# Altium schematic sheet ADPL_improved.SchDoc
size B
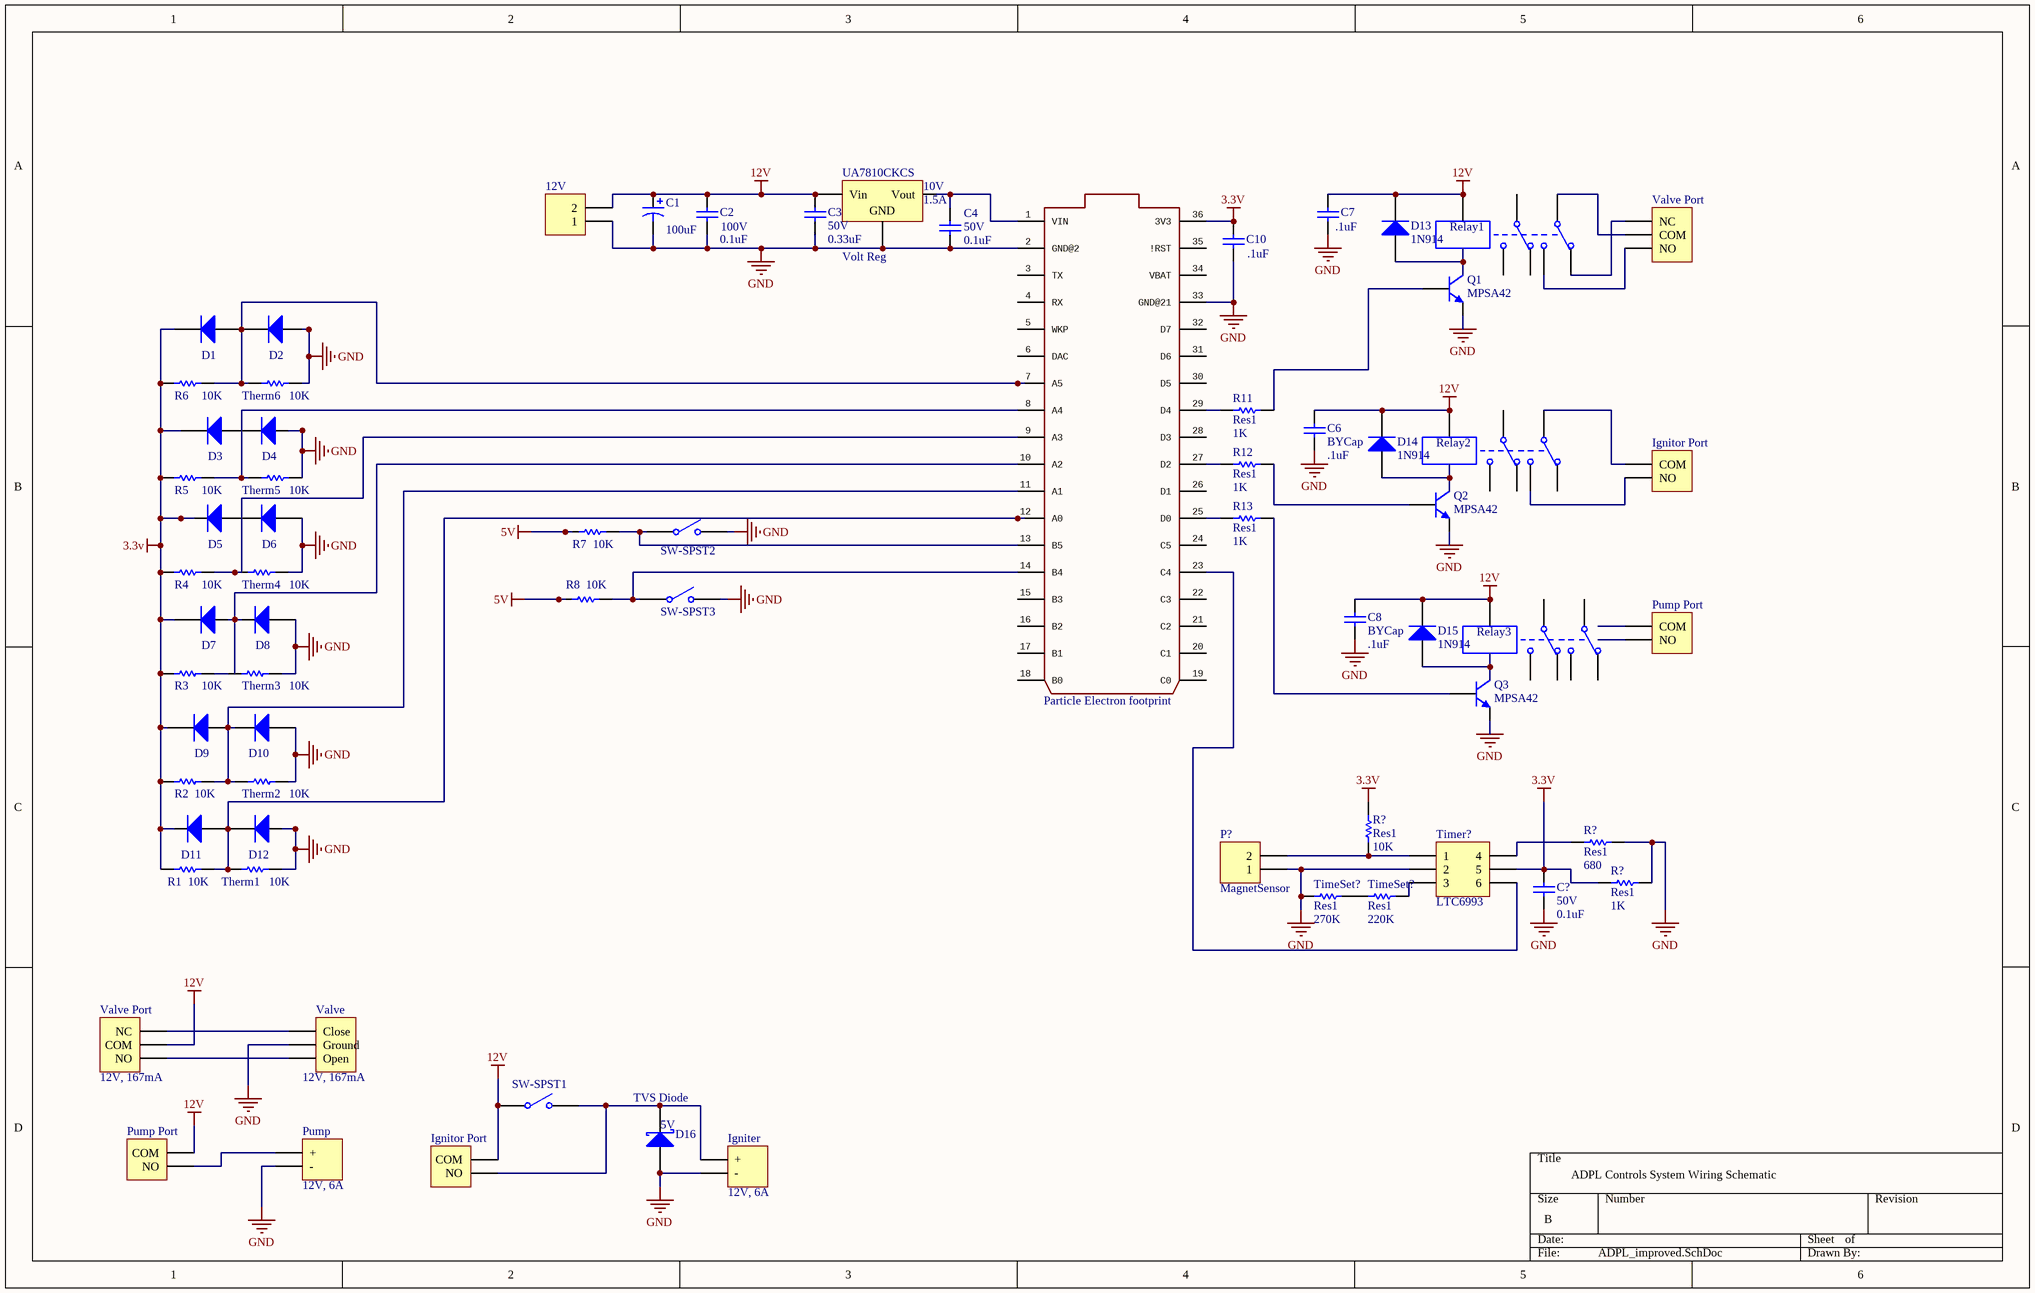
[diagram p0: ADPL_improved.SchDoc]

## Parts
(Parts that share a designator on the sheet are numbered #1, #2 ... from top to bottom, then left to right.)
12V  (no value)  [HDR1X2]
?  Particle Electron footprint  [ELECTRON]
C1  value 100uF  [RB7.6-15]  (hidden comment: 25V)
C2  100V  value 0.1uF  [C1206]
C3  50V  value 0.33uF  [RAD-0.3]
C4  50V  value 0.1uF  [RAD-0.3]
C6  BYCap  value .1uF  [C1206]
C7  value .1uF  [C1206]  (hidden comment: Cap)
C8  BYCap  value .1uF  [C1206]
C10  value .1uF  [C1206]  (hidden comment: BYCap)
C?  50V  value 0.1uF  [RAD-0.3]
D1  1N914  [DO-35]  (value not drawn)
D2  1N914  [DO-35]  (value not drawn)
D3  1N914  [DO-35]  (value not drawn)
D4  1N914  [DO-35]  (value not drawn)
D5  1N914  [DO-35]  (value not drawn)
D6  1N914  [DO-35]  (value not drawn)
D7  1N914  [DO-35]  (value not drawn)
D8  1N914  [DO-35]  (value not drawn)
D9  1N914  [DO-35]  (value not drawn)
D10  1N914  [DO-35]  (value not drawn)
D11  1N914  [DO-35]  (value not drawn)
D12  1N914  [DO-35]  (value not drawn)
D13  1N914  [DO-35]
D14  1N914  [DO-35]
D15  1N914  [DO-35]
D16  TVS Diode  Working Voltage: 5V  [TO-220AC]
Igniter  12V, 6A  [HDR1X2]
Ignitor_Port#1  1.5V, 280-320mA  [HDR1X2]  (value not drawn)
Ignitor_Port#2  (no value)  [HDR1X2]
P?  MagnetSensor  [HDR1X2]
Pump  12V, 6A  [HDR1X2]
Pump_Port#1  12V, 6A  [HDR1X2]  (value not drawn)
Pump_Port#2  (no value)  [HDR1X2]
Q1  MPSA42  [TO-92A]
Q2  MPSA42  [TO-92A]
Q3  MPSA42  [TO-92A]
R1  value 10K  [AXIAL-0.3]  (hidden comment: Res1)
R2  value 10K  [AXIAL-0.3]  (hidden comment: Res1)
R3  value 10K  [AXIAL-0.3]  (hidden comment: Res1)
R4  value 10K  [AXIAL-0.3]  (hidden comment: Res1)
R5  value 10K  [AXIAL-0.3]  (hidden comment: Res1)
R6  value 10K  [AXIAL-0.3]  (hidden comment: Res1)
R7  value 10K  [AXIAL-0.3]  (hidden comment: Res1)
R8  value 10K  [AXIAL-0.3]  (hidden comment: Res1)
R11  Res1  value 1K  [AXIAL-0.3]
R12  Res1  value 1K  [AXIAL-0.3]
R13  Res1  value 1K  [AXIAL-0.3]
R?#1  Res1  value 10K  [AXIAL-0.3]
R?#2  Res1  value 680  [AXIAL-0.3]
R?#3  Res1  value 1K  [AXIAL-0.3]
Relay1  817-FTR-F1CA012V  [Relay-DPDT_custom]  (value not drawn)
Relay2  817-FTR-F1CA012V  [Relay-DPDT_custom]  (value not drawn)
Relay3  817-FTR-F1CA012V  [Relay-DPDT_custom]  (value not drawn)
SW-SPST1  SW-SPST  [SPST-2]  (value not drawn)
SW-SPST2  SW-SPST  [SPST-2]  (value not drawn)
SW-SPST3  SW-SPST  [SPST-2]  (value not drawn)
Therm1  value 10K  [AXIAL-0.3]  (hidden comment: Res1)
Therm2  value 10K  [AXIAL-0.3]  (hidden comment: Res1)
Therm3  value 10K  [AXIAL-0.3]  (hidden comment: Res1)
Therm4  value 10K  [AXIAL-0.3]  (hidden comment: Res1)
Therm5  value 10K  [AXIAL-0.3]  (hidden comment: Res1)
Therm6  value 10K  [AXIAL-0.3]  (hidden comment: Res1)
Timer?  LTC6993  [LTC6993]
TimeSet?#1  Res1  value 270K  [AXIAL-0.3]
TimeSet?#2  Res1  value 220K  [AXIAL-0.3]
UA7810CKCS  Volt Reg  Voltage output: 10V  Current output: 1.5A  [D2PAK_N]
Valve  12V, 167mA  [HDR1X3]
Valve_Port#1  12V, 167mA  [HDR1X3]  (value not drawn)
Valve_Port#2  12V, 167mA  [HDR1X3]

## Nets
3.3V: ?.36(3V3) C10.2 C?.1 D1.2(K) D3.2(K) D5.2(K) D7.2(K) D9.2(K) D11.2(K) R1.2 R2.2 R3.2 R4.2 R5.2 R6.2 R?#1.2 R?#3.2 Timer?.5
5V: R7.2 R8.2
12V: 12V.2 C1.1 C2.2 C3.2 C6.2 C7.2 C8.2 D13.2(K) D14.2(K) D15.2(K) Ignitor_Port#2.2(COM) Pump_Port#2.2(COM) Relay1.7 Relay2.7 Relay3.7 SW-SPST1.1(COMMON) UA7810CKCS.1(Vin) Valve_Port#2.2(COM)
GND: 12V.1 ?.2(GND@2) ?.33(GND@21) C1.2 C2.1 C3.1 C4.1 C6.1 C7.1 C8.1 C10.1 C?.2 D2.1(A) D4.1(A) D6.1(A) D8.1(A) D10.1(A) D12.1(A) D16.3(A) Igniter.2(-) P?.1 Pump.2(-) Q1.1(E) Q2.1(E) Q3.1(E) R?#2.1 R?#3.1 SW-SPST2.2(NO) SW-SPST3.2(NO) Therm1.1 Therm2.1 Therm3.1 Therm4.1 Therm5.1 Therm6.1 Timer?.2 TimeSet?#1.1 UA7810CKCS.2(GND) Valve.2(Ground)
Net?_1: ?.1(VIN) C4.2 UA7810CKCS.3(Vout)
Net?_7: ?.7(A5) D1.1(A) D2.2(K) R6.1 Therm6.2
Net?_8: ?.8(A4) R5.1 Therm5.2
Net?_9: ?.9(A3) R4.1 Therm4.2
Net?_10: ?.10(A2) D7.1(A) D8.2(K)
Net?_11: ?.11(A1) D9.1(A) D10.2(K) R2.1 Therm2.2
Net?_12: ?.12(A0) D11.1(A) D12.2(K) R1.1 Therm1.2
Net?_13: ?.13(B5) R7.1 SW-SPST2.1(COMMON)
Net?_14: ?.14(B4) R8.1 SW-SPST3.1(COMMON)
Net?_23: ?.23(C4) Timer?.6
Net?_25: ?.25(D0) R13.1
Net?_27: ?.27(D2) R12.1
Net?_29: ?.29(D4) R11.1
NetD13_1: D13.1(A) Q1.3(C) Relay1.8
NetD14_1: D14.1(A) Q2.3(C) Relay2.8
NetD15_1: D15.1(A) Q3.3(C) Relay3.8
NetD16_1: D16.1(K) Igniter.1(+) Ignitor_Port#2.1(NO) SW-SPST1.2(NO)
NetIgnitor_Port#1_1: Ignitor_Port#1.1(COM) Relay2.1
NetIgnitor_Port#1_2: Ignitor_Port#1.2(NO) Relay2.3
NetP?_2: P?.2 R?#1.1 Timer?.1
NetPump_1: Pump.1(+) Pump_Port#2.1(NO)
NetQ1_2: Q1.2(B) R11.2
NetQ2_2: Q2.2(B) R12.2
NetQ3_2: Q3.2(B) R13.2
NetR3_1: R3.1 Therm3.2
NetR?#2_2: R?#2.2 Timer?.4
NetRelay1_1: Relay1.1 Valve_Port#1.2(COM)
NetRelay1_2: Relay1.2 Valve_Port#1.1(NC)
NetRelay1_3: Relay1.3 Valve_Port#1.3(NO)
NetTimer?_3: Timer?.3 TimeSet?#2.2
NetTimeSet?#1_2: TimeSet?#1.2 TimeSet?#2.1
NetValve_1: Valve.1(Close) Valve_Port#2.3(NC)
NetValve_3: Valve.3(Open) Valve_Port#2.1(NO)

Not connected (* = marked no-connect by the designer): ? 3(TX) 4(RX) 5(WKP) 6(DAC) 15(B3) 16(B2) 17(B1) 18(B0) 19(C0) 20(C1) 21(C2) 22(C3) 24(C5) 26(D1) 28(D3) 30(D5) 31(D6) 32(D7) 34(VBAT) 35(!RST); D3 1(A); D4 2(K); D5 1(A); D6 2(K); Pump_Port#1 1(COM) 2(NO); Relay1 4 5 6; Relay2 2 4 5 6; Relay3 1 2 3 4 5 6

## Notes on the sheet
- ADPL Controls System Wiring Schematic

## Library data of the parts
12V Ignitor_Port#1 Ignitor_Port#2 Pump_Port#1 Pump_Port#2 = Header 2: Header, 2-Pin; LatestRevisionDate: 17-Jul-2002; LatestRevisionNote: Re-released for DXP Platform.; Publisher: Altium Limited
? = ELECTRON_WITH_HEADERS
C1 = Cap Pol1: Polarized Capacitor (Radial); Published: 8-Jun-2000; LatestRevisionDate: 17-Jul-2002; LatestRevisionNote: Re-released for DXP Platform.; PackageReference: RB7.6-15; Publisher: Altium Limited; PackageDescription: Polarized Capacitor (Radial); 2 Leads
C2 C6-C8 C10 = Cap Semi: Capacitor (Semiconductor SIM Model); Part#: 581-SA111E104MAR; Published: 8-Jun-2000; LatestRevisionDate: 29-May-2009; LatestRevisionNote: IPC-7351 Footprint Added.; PackageReference: C1206; Publisher: Altium Limited; PackageDescription: Chip Capacitor
C3 C4 = Cap: Capacitor; Published: 8-Jun-2000; LatestRevisionDate: 17-Jul-2002; LatestRevisionNote: Re-released for DXP Platform.; PackageReference: RAD-0.3; Publisher: Altium Limited; PackageDescription: Radial Cap, Thru-Hole; 2 Leads; 0.3 in Pin Spacing
C? = cap: Capacitor; Published: 8-Jun-2000; LatestRevisionDate: 17-Jul-2002; LatestRevisionNote: Re-released for DXP Platform.; PackageReference: RAD-0.3; Publisher: Altium Limited; PackageDescription: Radial Cap, Thru-Hole; 2 Leads; 0.3 in Pin Spacing
D1-D15 = Diode 1N914: High Conductance Fast Diode; Published: 8-Jun-2000; LatestRevisionDate: 17-Jul-2002; LatestRevisionNote: Re-released for DXP Platform.; DatasheetVersion: 1997; PackageReference: DO-35; Publisher: Altium Limited; PackageDescription: Diode, Axial; Body 3.8 x 1.9 mm (LxDia. max), Lead Dia. 0.53 mm (max); Code_JEDEC: DO-204-AH; ComponentLink1Description: Manufacturer Link; ComponentLink1URL: http://www.fairchildsemi.com/; ComponentLink2Description: Datasheet; ComponentLink2URL: http://www.fairchildsemi.com/ds/1N%2F1N4448.pdf
D16 = Diode 10TQ040: TVS Diode - Birectional; Part#: SA5.0CA; Note: Terminal 2 is the TAB and is electrically connected to the cathode; Clamping voltage: 9.6V; Published: 8-Jun-2000; LatestRevisionDate: 17-Jul-2002; LatestRevisionNote: Re-released for DXP Platform.; DatasheetVersion: PD-2.057B; PackageVersion: Feb-1998; PackageReference: TO-220AC; Publisher: Altium Limited; PackageDescription: TO, Thru-Hole, Vertical, Heatsink Mounted; 3 In-Line Leads (1 Absent); Pitch 2.54 mm; ComponentLink1Description: Manufacturer Link; ComponentLink1URL: http://www.irf.com/
Igniter Pump = Header 2: Header, 2-Pin; Input: 1.5VDC, 280-320mA; LatestRevisionDate: 17-Jul-2002; LatestRevisionNote: Re-released for DXP Platform.; Publisher: Altium Limited
P? = Header 2: Header, 2-Pin; Resistance: Contact on maximum resistance: ≤10kΩ   Open contact minimum resistance: ≥500kΩ; LatestRevisionDate: 17-Jul-2002; LatestRevisionNote: Re-released for DXP Platform.; Publisher: Altium Limited; Source: http://www.amazon.com/GERI-Counter-Digital-Proximity-Magnetic/dp/B01875612U/ref=sr_1_2?ie=UTF8&qid=1456764906&sr=8-2&keywords=magnetic+counter
Q1-Q3 = 2N3904: NPN General Purpose Amplifier; Part#: 512-MPSA42; Published: 8-Jun-2000; LatestRevisionDate: 17-Jan-2003; LatestRevisionNote: PCB Footprint replaced; DatasheetVersion: 1997; PackageVersion: Sep-1998; PackageReference: TO-92A; Publisher: Altium Limited; PackageDescription: TO, Flat Index; 3 In-Line, Axial Leads; Body Dia. 4.5mm; Leads 0.51 x 0.48 mm (max); ComponentLink1Description: Manufacturer Link; ComponentLink1URL: http://www.fairchildsemi.com/; ComponentLink2Description: Datasheet; ComponentLink2URL: http://www.fairchildsemi.com/ds/2N%2F2N3904.pdf
R1-R8 R11-R13 R?#1 = Res1: Resistor; Published: 8-Jun-2000; LatestRevisionDate: 17-Jul-2002; LatestRevisionNote: Re-released for DXP Platform.; PackageReference: AXIAL-0.3; Publisher: Altium Limited; PackageDescription: Axial Device, Thru-Hole; 2 Leads; 0.3 in Pin Spacing
R?#2 = Res1: Resistor; Part#: 660-CF1/4C681J; Published: 8-Jun-2000; LatestRevisionDate: 17-Jul-2002; LatestRevisionNote: Re-released for DXP Platform.; PackageReference: AXIAL-0.3; Publisher: Altium Limited; PackageDescription: Axial Device, Thru-Hole; 2 Leads; 0.3 in Pin Spacing
R?#3 = Res1: Resistor; Part#: 660-CF1/4CT52R102J; Published: 8-Jun-2000; LatestRevisionDate: 17-Jul-2002; LatestRevisionNote: Re-released for DXP Platform.; PackageReference: AXIAL-0.3; Publisher: Altium Limited; PackageDescription: Axial Device, Thru-Hole; 2 Leads; 0.3 in Pin Spacing
Relay1-Relay3 = Relay-DPDT_custom: Dual-Pole Dual-Throw Relay; Published: 24-Mar-1999; LatestRevisionDate: 17-Jul-2002; LatestRevisionNote: Re-released for DXP Platform.; PackageReference: DIP-P8; Publisher: Altium Limited; PackageDescription: Relay; 8 Leads
SW-SPST1-SW-SPST3 = SW-SPST: Single-Pole, Single-Throw Switch; Published: 24-Mar-1999; LatestRevisionDate: 17-Jul-2002; LatestRevisionNote: Re-released for DXP Platform.; PackageReference: SPST-2; Publisher: Altium Limited; PackageDescription: Switch; 2 Leads
Therm1 Therm2 Therm4-Therm6 = Res1: Resistor; Part#: NTCAIMME3C90373; Published: 8-Jun-2000; LatestRevisionDate: 17-Jul-2002; LatestRevisionNote: Re-released for DXP Platform.; PackageReference: AXIAL-0.3; Publisher: Altium Limited; PackageDescription: Axial Device, Thru-Hole; 2 Leads; 0.3 in Pin Spacing
Therm3 = Res1: Resistor; Part#: Dwyer I2-1B062; Published: 8-Jun-2000; LatestRevisionDate: 17-Jul-2002; LatestRevisionNote: Re-released for DXP Platform.; PackageReference: AXIAL-0.3; Publisher: Altium Limited; PackageDescription: Axial Device, Thru-Hole; 2 Leads; 0.3 in Pin Spacing
TimeSet?#1 = Res1: Resistor; Part#: 660-CF1/4CT52R274J; Published: 8-Jun-2000; LatestRevisionDate: 17-Jul-2002; LatestRevisionNote: Re-released for DXP Platform.; PackageReference: AXIAL-0.3; Publisher: Altium Limited; PackageDescription: Axial Device, Thru-Hole; 2 Leads; 0.3 in Pin Spacing
TimeSet?#2 = Res1: Resistor; Part#: 660-CF1/4CT52R224J; Published: 8-Jun-2000; LatestRevisionDate: 17-Jul-2002; LatestRevisionNote: Re-released for DXP Platform.; PackageReference: AXIAL-0.3; Publisher: Altium Limited; PackageDescription: Axial Device, Thru-Hole; 2 Leads; 0.3 in Pin Spacing
UA7810CKCS = Volt Reg: Voltage Regulator; Part#: UA7810CKCS; Voltage input: 12.5-28V; Published: 24-Mar-1999; LatestRevisionDate: 29-May-2009; LatestRevisionNote: IPC-7351 Footprint Added.; PackageReference: D2PAK; Publisher: Altium Limited; PackageDescription: 3-Pin Transistor Outline Package 2.54 mm Pitch, 15.1 mm Lead Span
Valve Valve_Port#1 Valve_Port#2 = Header 3: Header, 3-Pin; Part#: CWX-15Q, CR-02; LatestRevisionDate: 17-Jul-2002; LatestRevisionNote: Re-released for DXP Platform.; Publisher: Altium Limited